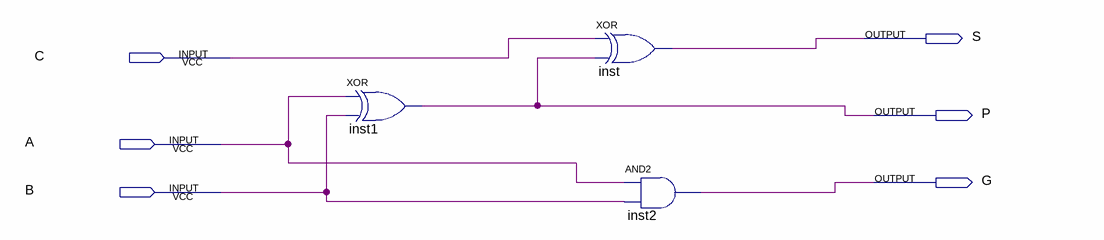
[diagram p0: schematic sheet]
// Quartus schematic FAcla.bdf as structural Verilog: 3 symbols, 6 pins
module FAcla (
  input  C,
  input  A,
  input  B,
  output S,
  output P,
  output G
);

  xor inst1 (P, A, B);
  xor inst (S, C, P);
  and inst2 (G, A, B);
endmodule
